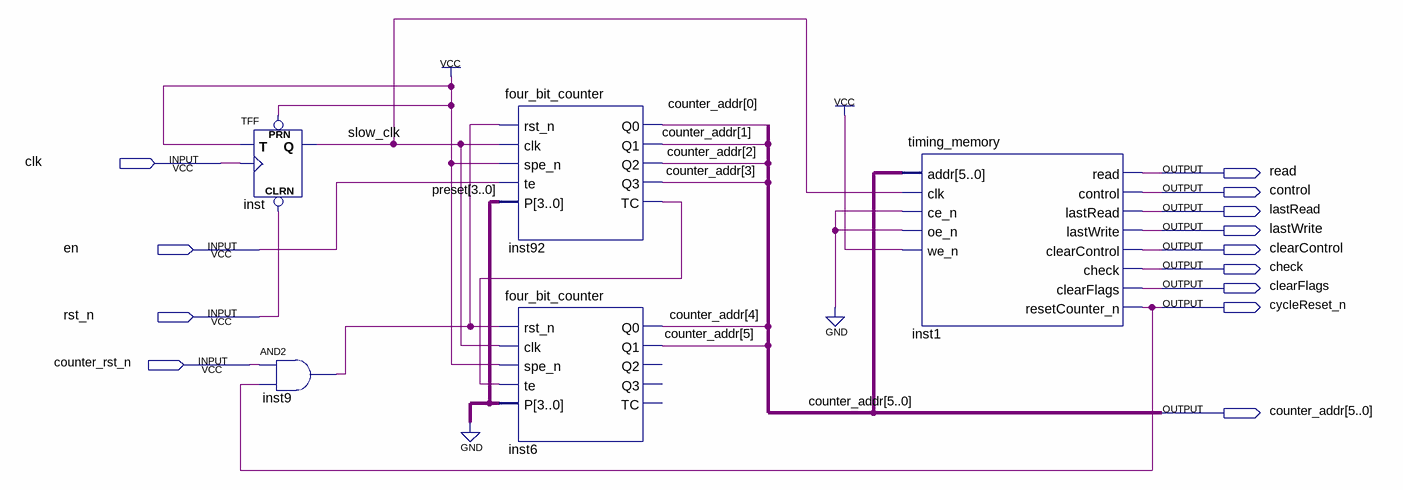
[diagram p0: schematic sheet]
// Quartus schematic timing_module.bdf as structural Verilog: 5 symbols, 13 pins
module timing_module (
  input  clk,
  input  en,
  input  rst_n,
  input  counter_rst_n,
  output read,
  output control,
  output lastRead,
  output lastWrite,
  output clearControl,
  output check,
  output clearFlags,
  output cycleReset_n,
  output [5:0] counter_addr
);

  wire inst9_out, inst92_tc, slow_clk;

  TFF inst (.PRN(1'b1), .CLRN(rst_n), .T(1'b1), .CLK(clk), .Q(slow_clk));
  and inst9 (inst9_out, counter_rst_n, cycleReset_n);
  four_bit_counter inst92 (
    .rst_n(inst9_out), .clk(slow_clk), .spe_n(1'b1), .te(en), .P(4'b0000), .Q0(counter_addr[0]),
    .Q1(counter_addr[1]), .Q2(counter_addr[2]), .Q3(counter_addr[3]), .TC(inst92_tc));
  four_bit_counter inst6 (
    .rst_n(inst9_out), .clk(slow_clk), .spe_n(1'b1), .te(inst92_tc), .P(4'b0000), .Q0(counter_addr[4]),
    .Q1(counter_addr[5]));  // open: Q2, Q3, TC
  timing_memory inst1 (
    .addr(counter_addr), .clk(slow_clk), .ce_n(1'b0), .oe_n(1'b0), .we_n(1'b1), .read(read),
    .control(control), .lastRead(lastRead), .lastWrite(lastWrite), .clearControl(clearControl),
    .check(check), .clearFlags(clearFlags), .resetCounter_n(cycleReset_n));
endmodule
